# Altium project ASV4-1 Actuation Driver Board.PrjPcb (part 2 of 3)

## Sheet ISO_CAN.SchDoc
size C; SheetNumber: 6; SheetTotal: 6
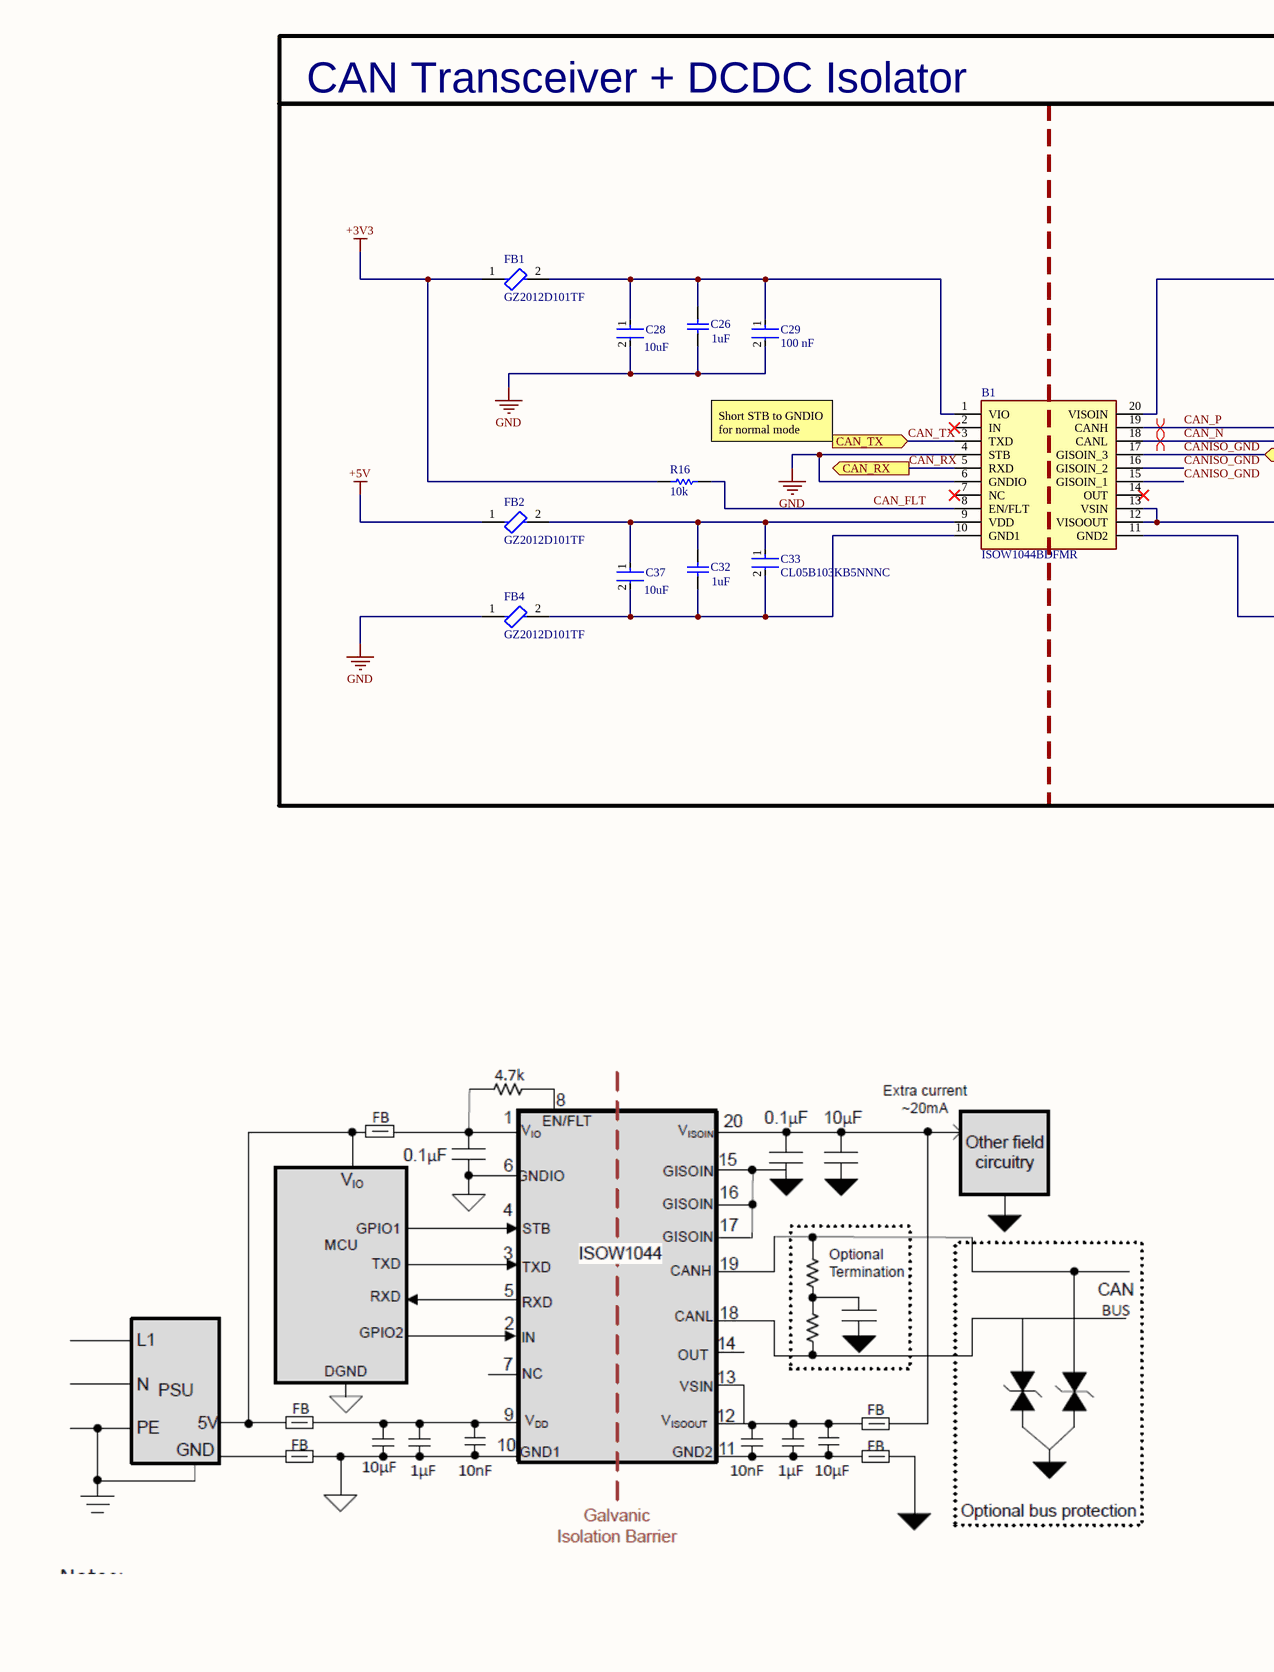
[diagram p4: ISO_CAN.SchDoc, top left]
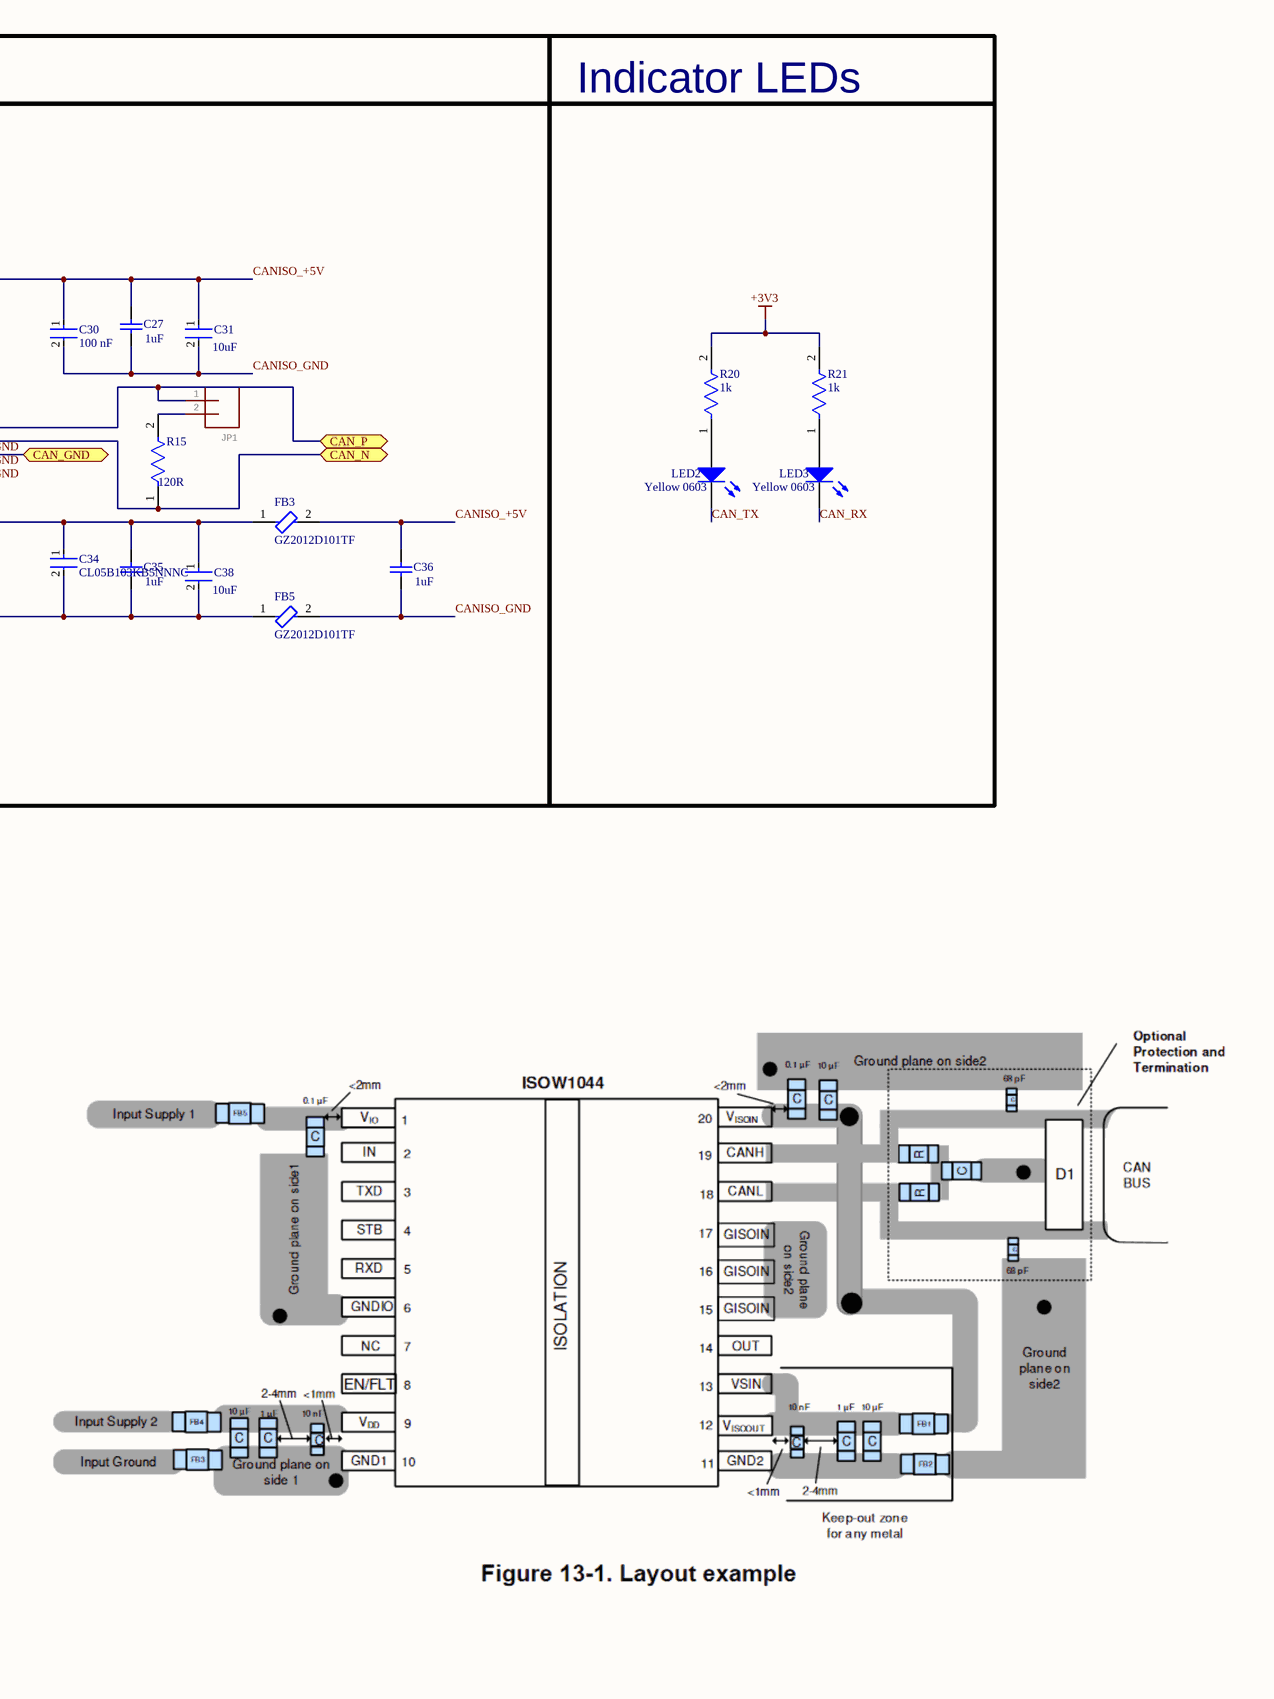
[diagram p5: ISO_CAN.SchDoc, top right]
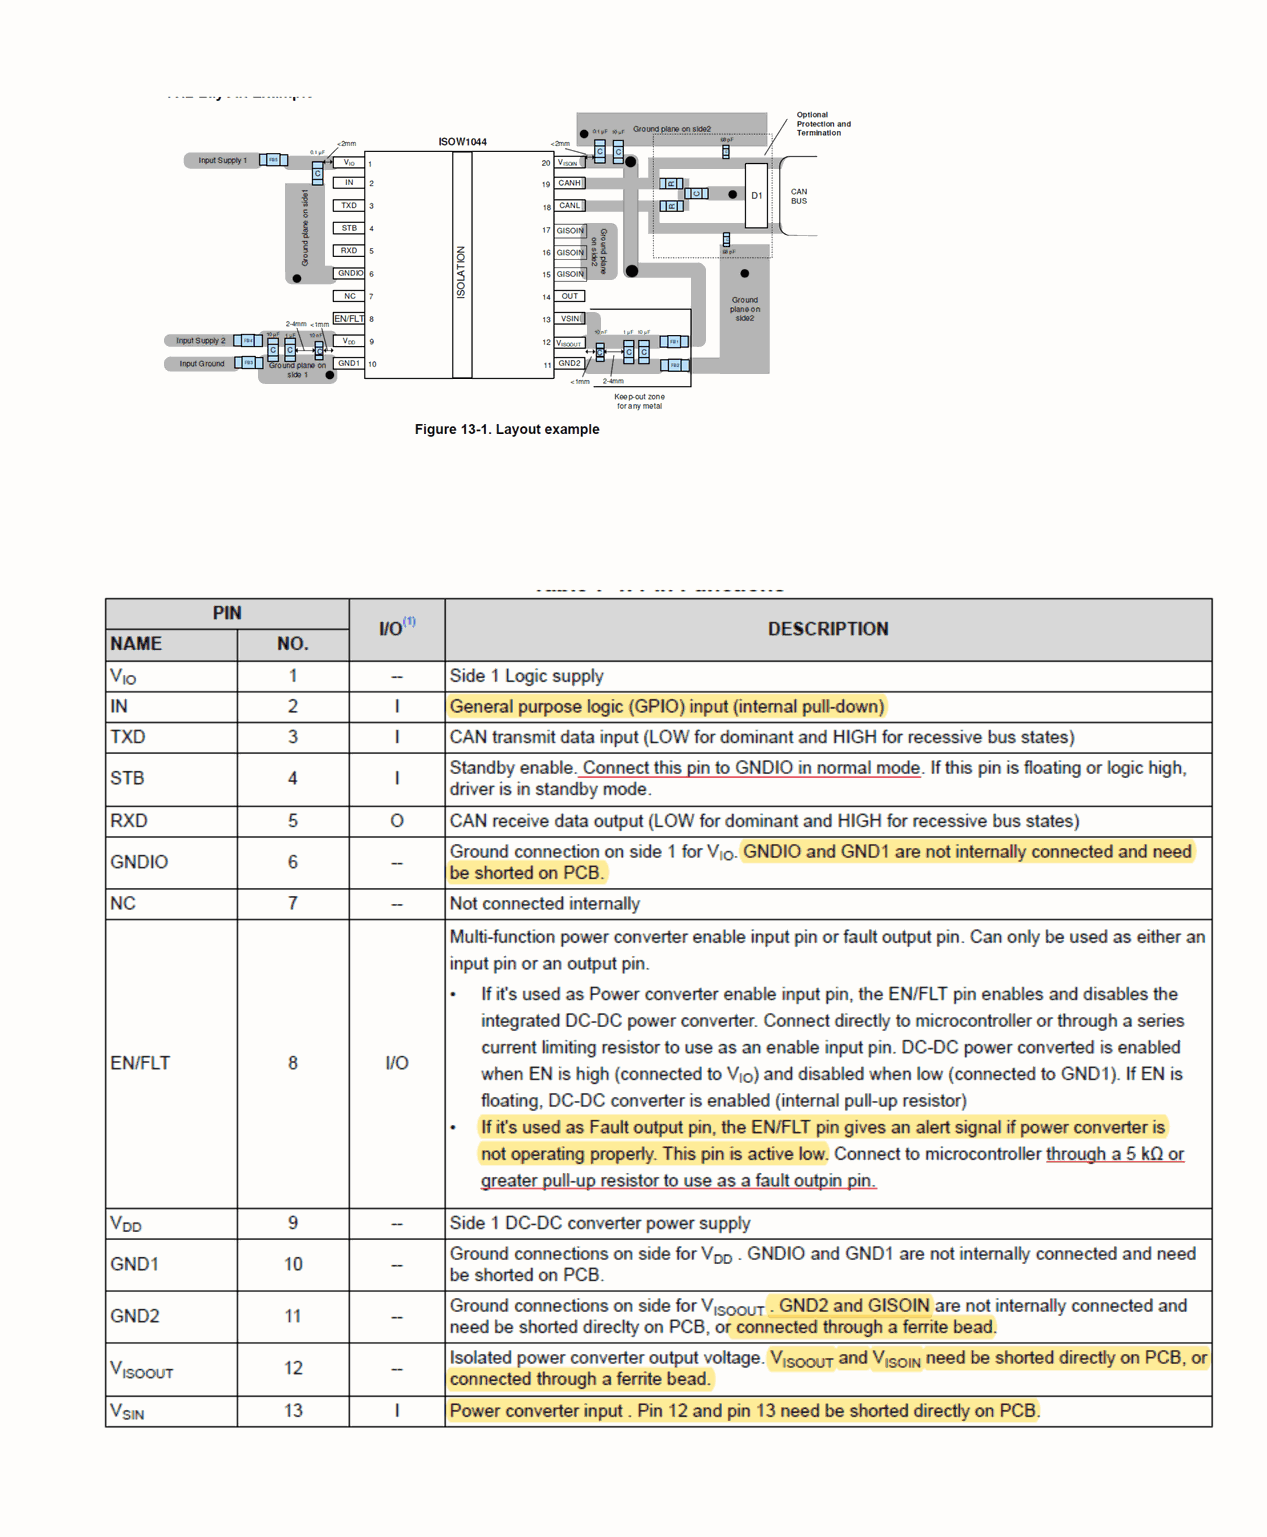
[diagram p6: ISO_CAN.SchDoc, bottom left]
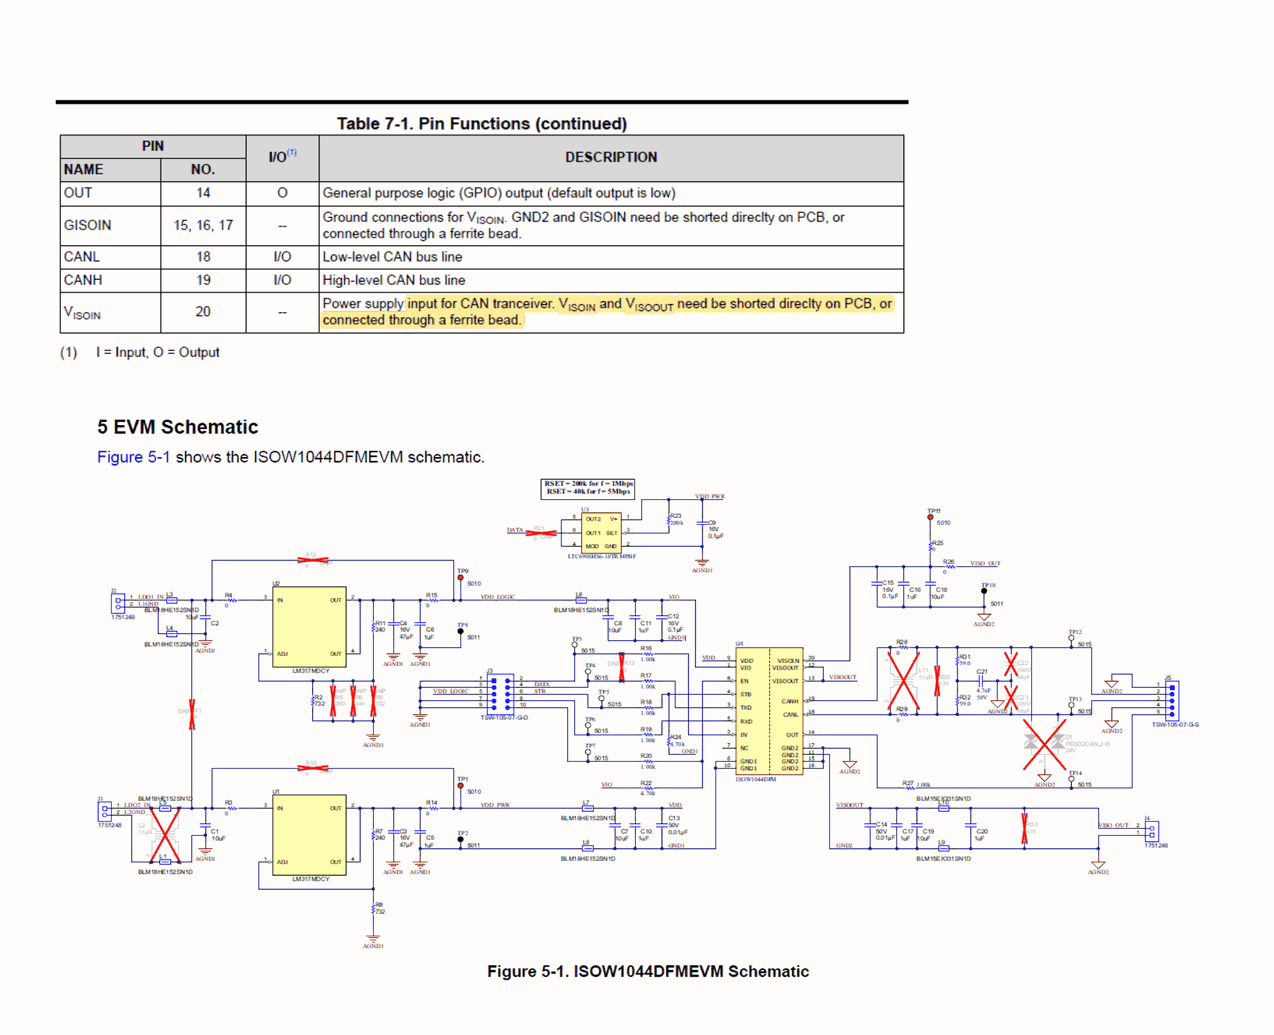
[diagram p7: ISO_CAN.SchDoc, bottom right]

### Parts
B1  ISOW1044BDFMR  [SOIC127P1030X355-20N]
C26  value 1uF  [CAPC1608X95N]  (hidden comment: 1uF 0603)
C27  value 1uF  [CAPC1608X95N]  (hidden comment: 1uF 0603)
C28  Capacitance: 10uF  [FP-GRM21B-0_2-e0_2_0_7-IPC_A]  (hidden comment: GRM21BR61H106KE43L)
C29  Capacitance: 100 nF  [FP-CC0603-DA-MFG]  (hidden comment: CC0603KRX7R9BB104)
C30  Capacitance: 100 nF  [FP-CC0603-DA-MFG]  (hidden comment: CC0603KRX7R9BB104)
C31  Capacitance: 10uF  [FP-GRM21B-0_2-e0_2_0_7-IPC_A]  (hidden comment: GRM21BR61H106KE43L)
C32  value 1uF  [CAPC1608X95N]  (hidden comment: 1uF 0603)
C33  CL05B103KB5NNNC  [FP-CL165-IPC_C]
C34  CL05B103KB5NNNC  [FP-CL165-IPC_C]
C35  value 1uF  [CAPC1608X95N]  (hidden comment: 1uF 0603)
C36  value 1uF  [CAPC1608X95N]  (hidden comment: 1uF 0603)
C37  Capacitance: 10uF  [FP-GRM21B-0_2-e0_2_0_7-IPC_A]  (hidden comment: GRM21BR61H106KE43L)
C38  Capacitance: 10uF  [FP-GRM21B-0_2-e0_2_0_7-IPC_A]  (hidden comment: GRM21BR61H106KE43L)
FB1  GZ2012D101TF  [FP-BLM21-0_2-t0_85-e0_5-IPC_A]
FB2  GZ2012D101TF  [FP-BLM21-0_2-t0_85-e0_5-IPC_A]
FB3  GZ2012D101TF  [FP-BLM21-0_2-t0_85-e0_5-IPC_A]
FB4  GZ2012D101TF  [FP-BLM21-0_2-t0_85-e0_5-IPC_A]
FB5  GZ2012D101TF  [FP-BLM21-0_2-t0_85-e0_5-IPC_A]
JP1  Multi connection point. Often used as Generic Header-pin footprint for 0.1 inch spaced/style header connections    On any of the 0.1 inch spaced packages, you can populate with these:  Break Away Headers - Straight (PRT-00116)   Break Away Male Headers - Right Angle (PRT-00553)   Female Headers (PRT-00115)   Break Away Headers - Machine Pin (PRT-00117)   Break Away Female Headers - Swiss Machine Pin (PRT-00743)        For SCREWTERMINALS and SPRING TERMINALS visit here:  Screw Terimnals on SparkFun.com (5mm/3.5mm/2.54mm spacing)       This device is also useful as a general connection point to wire up your design to another part of your project. Our various solder wires solder well into these plated through hole pads.  Hook-Up Wire - Assortment (Stranded, 22 AWG) (PRT-11375)   Hook-Up Wire - Assortment (Solid Core, 22 AWG) (PRT-11367)   View the entire wire category on our website here          Special notes: Molex polarized connector foot print use with: PRT-08233 with associated crimp pins and housings.  2.54_SCREWTERM for use with  PRT-10571.  3.5mm Screw Terminal footprints for  PRT-08084  5mm Screw Terminal footprints for use with PRT-08432  [1X02_LOCK]  (value not drawn)
LED2  Yellow 0603  [0603_A]
LED3  Yellow 0603  [0603_A]
R15  Resistance: 120R  [FP-CRCW0603-e3-MFG]  (hidden comment: 0603WAF1200T5E)
R16  Resistance: 10k  [RESC1609X50X30NL8T20]  (hidden comment: 0603WAF1002T5E)
R20  1k  [FP-RC0603-0_55-IPC_C]
R21  1k  [FP-RC0603-0_55-IPC_C]

### Blocks framed on the sheet
CAN Transceiver + DCDC Isolator: B1 C26-C38 FB1-FB5 JP1 R15 R16
Indicator LEDs: LED2 LED3 R20 R21

### Ports
CAN_GND (bidir, see Actuation[2A]), CAN_N (bidir, see Actuation[2A]), CAN_P (bidir, see Actuation[2A]), CAN_RX (out, see Actuation[2A]), CAN_TX (in, see Actuation[2A])

### Nets
+3V3: FB1.1 R16.1 R20.2 R21.2
+5V: FB2.1
GND: B1.4(STB) B1.6(GNDIO) C26.1 C28.2 C29.2 FB4.1
CAN_FLT: B1.8(EN/FLT) R16.2
CAN_N: B1.18(CANL) R15.1 ; port CAN_N
CAN_P: B1.19(CANH) JP1.1 ; port CAN_P
CAN_RX: B1.5(RXD) LED3.1(K) ; port CAN_RX  [project net CAN1_RX]
CAN_TX: B1.3(TXD) LED2.1(K) ; port CAN_TX  [project net CAN1_TX]
CANISO_+5V: B1.20(VISOIN) C27.2 C30.1 C31.1 C36.2 FB3.2
CANISO_GND: B1.15(GISOIN_1) B1.16(GISOIN_2) B1.17(GISOIN_3) C27.1 C30.2 C31.2 C36.1 FB5.2 ; port CAN_GND  [project net CAN_GND_ISO]
NetB1_1: B1.1(VIO) C26.2 C28.1 C29.1 FB1.2
NetB1_9: B1.9(VDD) C32.2 C33.1 C37.1 FB2.2
NetB1_10: B1.10(GND1) C32.1 C33.2 C37.2 FB4.2
NetB1_11: B1.11(GND2) C34.2 C35.1 C38.2 FB5.1
NetB1_12: B1.12(VISOOUT) B1.13(VSIN) C34.1 C35.2 C38.1 FB3.1
NetJP1_2: JP1.2 R15.2
NetLED2_2: LED2.2(A) R20.1
NetLED3_2: LED3.2(A) R21.1

Not connected (* = marked no-connect by the designer): B1 2(IN)* 7(NC)* 14(OUT)*

### Layout directives
differential pair: CAN_N, CAN_P

### Notes on the sheet
- Short STB to GNDIO for normal mode

### Library data of the parts
B1 = CMP-194-000000-2: Texas Instruments; Geometry.Height: 3.55mm; Mouser Price/Stock: https://www.mouser.co.uk/ProductDetail/Texas-Instruments/ISOW1044BDFMR?qs=Li%252BoUPsLEnsRP1xV2fQwnw%3D%3D; Source: ISOW1044BDFMR.SchLib; Manufacturer_Part_Number: ISOW1044BDFMR; Design Item ID: ISOW1044BDFMR; Manufacturer_Name: Texas Instruments; Datasheet Link: https://www.ti.com/lit/ds/symlink/isow1044.pdf?ts=1645295421849&ref_url=https%253A%252F%252Fwww.google.com%252F; Mouser Part Number: 595-ISOW1044BDFMR
C26 C27 C32 C35 C36 = CMP-00099-1: as C20 on sheet Power; Capacitor Type: Ceramic; Height: 0.9mm; Package Shape: Rectangular; JESD-609 Code: e3; Terminal Finish: Nickel; Length: 1.6mm; Package Style: SMTMeter; RoHS Compliant: Yes; Mounting Technology: Surface Mount; Case/Package: 0603; Rated DC Voltage (URdc): 50V; Pins: 2; Min Operating Temperature: -55°C; Max Operating Temperature: 85°C; Dielectric Material: Ceramic; Width: 0.8mm; Termination: Wraparound; Packaging: Tape and Reel; Tolerance (fill in as +-): 10%; Tolerance  (fill in as +-): 10%; Reach SVHC Compliant: Yes; Temperature Characteristics Code: X5R
C28 C31 C37 C38 = CMP-06035-004402-1: Chip Multilayer Ceramic Capacitors for General Purpose, 0805, 10uF, X5R, 15%, 10%, 50V; Voltage Rating (DC): 50V; Dielectric: X5R; Tolerance: 10%; Thickness: 1.25mm; Length: 2mm; Width: 1.25mm
C29 C30 = CMP-2100-03601-2: as C4 on sheet Actuation; Height: 0.9mm; Voltage: 50 V; ComponentLink2Description: Datasheet; Device Class L2: Capacitors; Temperature Range High: +125°C; Category: Cap; Footprint Url: http://www.yageo.com/exep/pages/download/literatures/UPY-C_GEN_24.pdf; ComponentLink2URL: http://www.yageo.com/documents/recent/UPY-GPHC_X7R_6.3V-to-50V_18.pdf; Package: CC0603-DA; Temperature: -55°C to +125°C; Voltage Rating: 50 V; Temperature Characteristic: X7R; Device Class L1: Passive Components; Temperature Range Low: -55°C; Manufacturer Part Number: CC0603KRX7R9BB104; RoHS: TRUE; Automotive: No; Device Class L3: Ceramic Capacitors; Octopart: https://octopart.com/cc0603krx7r9bb104-yageo-42244635; Mouser Description: Multilayer Ceramic Capacitor, CC Series, 0.1 - F, - 10%, X7R, 50 V, 0603 [1608 Metric]; Lead Free: Yes; Digikey Description: CAP CER 0.1UF 50V X7R 0603
C33 C34 = CMP-13271-000387-1: Cap Ceramic 10nF 50V X7R ±10% SMD 0402 +125°C Paper T/R; Depth: 0.5mm; Length: 1mm; Lead Free: Lead Free; Case Code (Metric): 1005; Width: 0.02inch; Min Operating Temperature: -55°C; Thickness: 0.022inch; Package Quantity: 1; Mount: Surface Mount; Height: 0.5mm; Voltage: 50V; Material: Ceramic; Tolerance: 10%; Case Code (Imperial): 0402; Radiation Hardening: No; Case/Package: 0402; Max Operating Temperature: 125°C; Voltage Rating (DC): 50V; Contact Plating: Tin; Packaging: Tape and Reel; Voltage Rating: 50V; Capacitance: 10nF; Dielectric: X7R
FB1-FB5 = CMP-0686-00716-3: ±25% 100Ω@100MHz 0805 Ferrite Beads ROHS; Number of Lines: 1; Test Frequency: 100MHz; Impedance: 100R; Width: 1.25mm; Number of Circuits: 1; Height: 0.85mm; Min Operating Temperature: -55°C; Termination: SMD/SMT; Core Material: Ferrite; Number of Pins: 2; Case/Package: 0805; Case Code (Imperial): 0805; Frequency: 100MHz; Depth: 1.25mm; Length: 2mm; Case Code (Metric): 2012
JP1 = CONN_02LOCK: GateName_1: J1; DeviceName: LOCK; SymbolName_1: CONN_02; LibraryName: SparkFun-Connectors; DeviceSetName: CONN_02; Package: 1X02_LOCK
LED2 LED3 = CMP-00009-2: Led, Yellow, 590 Nm, 2 V, 30 Ma, 120 Mcd Rohs Compliant: Yes; Manufacturer Part No.: 150060YS75000; Test Current: 20mA; Dominant Wavelength: 590nm; Forward Current: 30mA; Viewing Angle: 140°; Lens Style: Clear,Rectangular; Forward Voltage: 2V; Luminous Intensity: 120mcd; Package Quantity: 1; Width: 0.8mm; Reach SVHC Compliant: Unknown; RoHS Compliant: Yes; Packaging: Cut Tape; Case Code (Imperial): 0603; Color: Yellow; Max Operating Temperature: 85°C; Case Code (Metric): 1608; Wavelength: 590nm; Series: WL-SMCW; Min Operating Temperature: -40°C; Case/Package: 0603; Height: 0.7mm; Length: 1.6mm; Mounting Technology: Surface Mount
R15 = CMP-1666-00020-3: 100mW Thick Film Resistors 75V ±100ppm/℃ ±1% 120Ω 0603 Chip Resistor - Surface Mount ROHS; Temperature Coefficient: 100ppm/°C; RoHS Compliant: Yes; Lead Free: Lead Free; Termination: SMD/SMT; Radiation Hardening: No; Case Code (Imperial): 0603; Series: CRCW; Resistance Tolerance: 1%; Number of Terminations: 2; Tolerance: 1%; Max Operating Temperature: 155°C; Power Rating: 100mW; Contact Plating: Tin; Package Quantity: 10; Max Power Dissipation: 100mW; Case Code (Metric): 1608; Weight: 7.1E-05oz; Packaging: Tape and Reel; Working Voltage: 75V; Mount: Surface Mount; Military Standard: Not; Construction: Rectangular; Features: Automotive AEC-Q200; Depth: 0.85mm; Min Operating Temperature: -55°C; Case/Package: 0603; Height: 0.45mm; Voltage Rating (DC): 75V; Width: 0.033inch; Technology: THICK FILM; Length: 1.55mm; Voltage Rating: 75V; Resistor Type: Thick Film
R16 = CMP-1666-00005-4: as R18 on sheet Actuation; Max Operating Temperature: 155 degC; Voltage Rating: 75 V; PackageDescription: 2-Pin Surface Mount Device, Body 1.575 x 0.85 mm; ComponentLink1Description: Manufacturer URL; RoHSCompliant: true; PackageReference: 0603; REACH SVHC: Unknown; Length: 1.55 mm; Packaging: Tape and Reel; Min Operating Temperature: -55 degC; Mounting Technology: Surface Mount; ComponentLink2URL: https://datasheet.ciiva.com/11809/0900766b80d98afc-11809037.pdf; Height: 0.45 mm; ComponentLink2Description: Datasheet; Package Quantity: 5000; ComponentLink1URL: http://www.vishay.com/
R20 R21 = CMP-1659-00009-5: as R17 on sheet Actuation; Military Standard: Not; REACH SVHC: No SVHC; Size Code: 0603; Features: Moisture Resistant; Number of Terminations: 2; Technology: THICK FILM; Series: RC; Case Code (Metric): 1608; Resistance Tolerance: 1%; Resistor Type: Thick Film; Termination: SMD/SMT; Contact Plating: Tin; Radiation Hardening: No; Min Operating Temperature: -55°C; Max Operating Temperature: 155°C; Packaging: Tape and Reel; Max Power Dissipation: 100mW; RoHS Compliant: Yes; Height: 0.45mm; Lead Free: Lead Free; Case/Package: 0603; Length: 1.6mm; Tolerance: 1%; Case Code (Imperial): 0603; Construction: Rectangular; Depth: 0.8mm

## Sheet STM32F407VET6.SchDoc
size A3; SheetNumber: 2; SheetTotal: 6
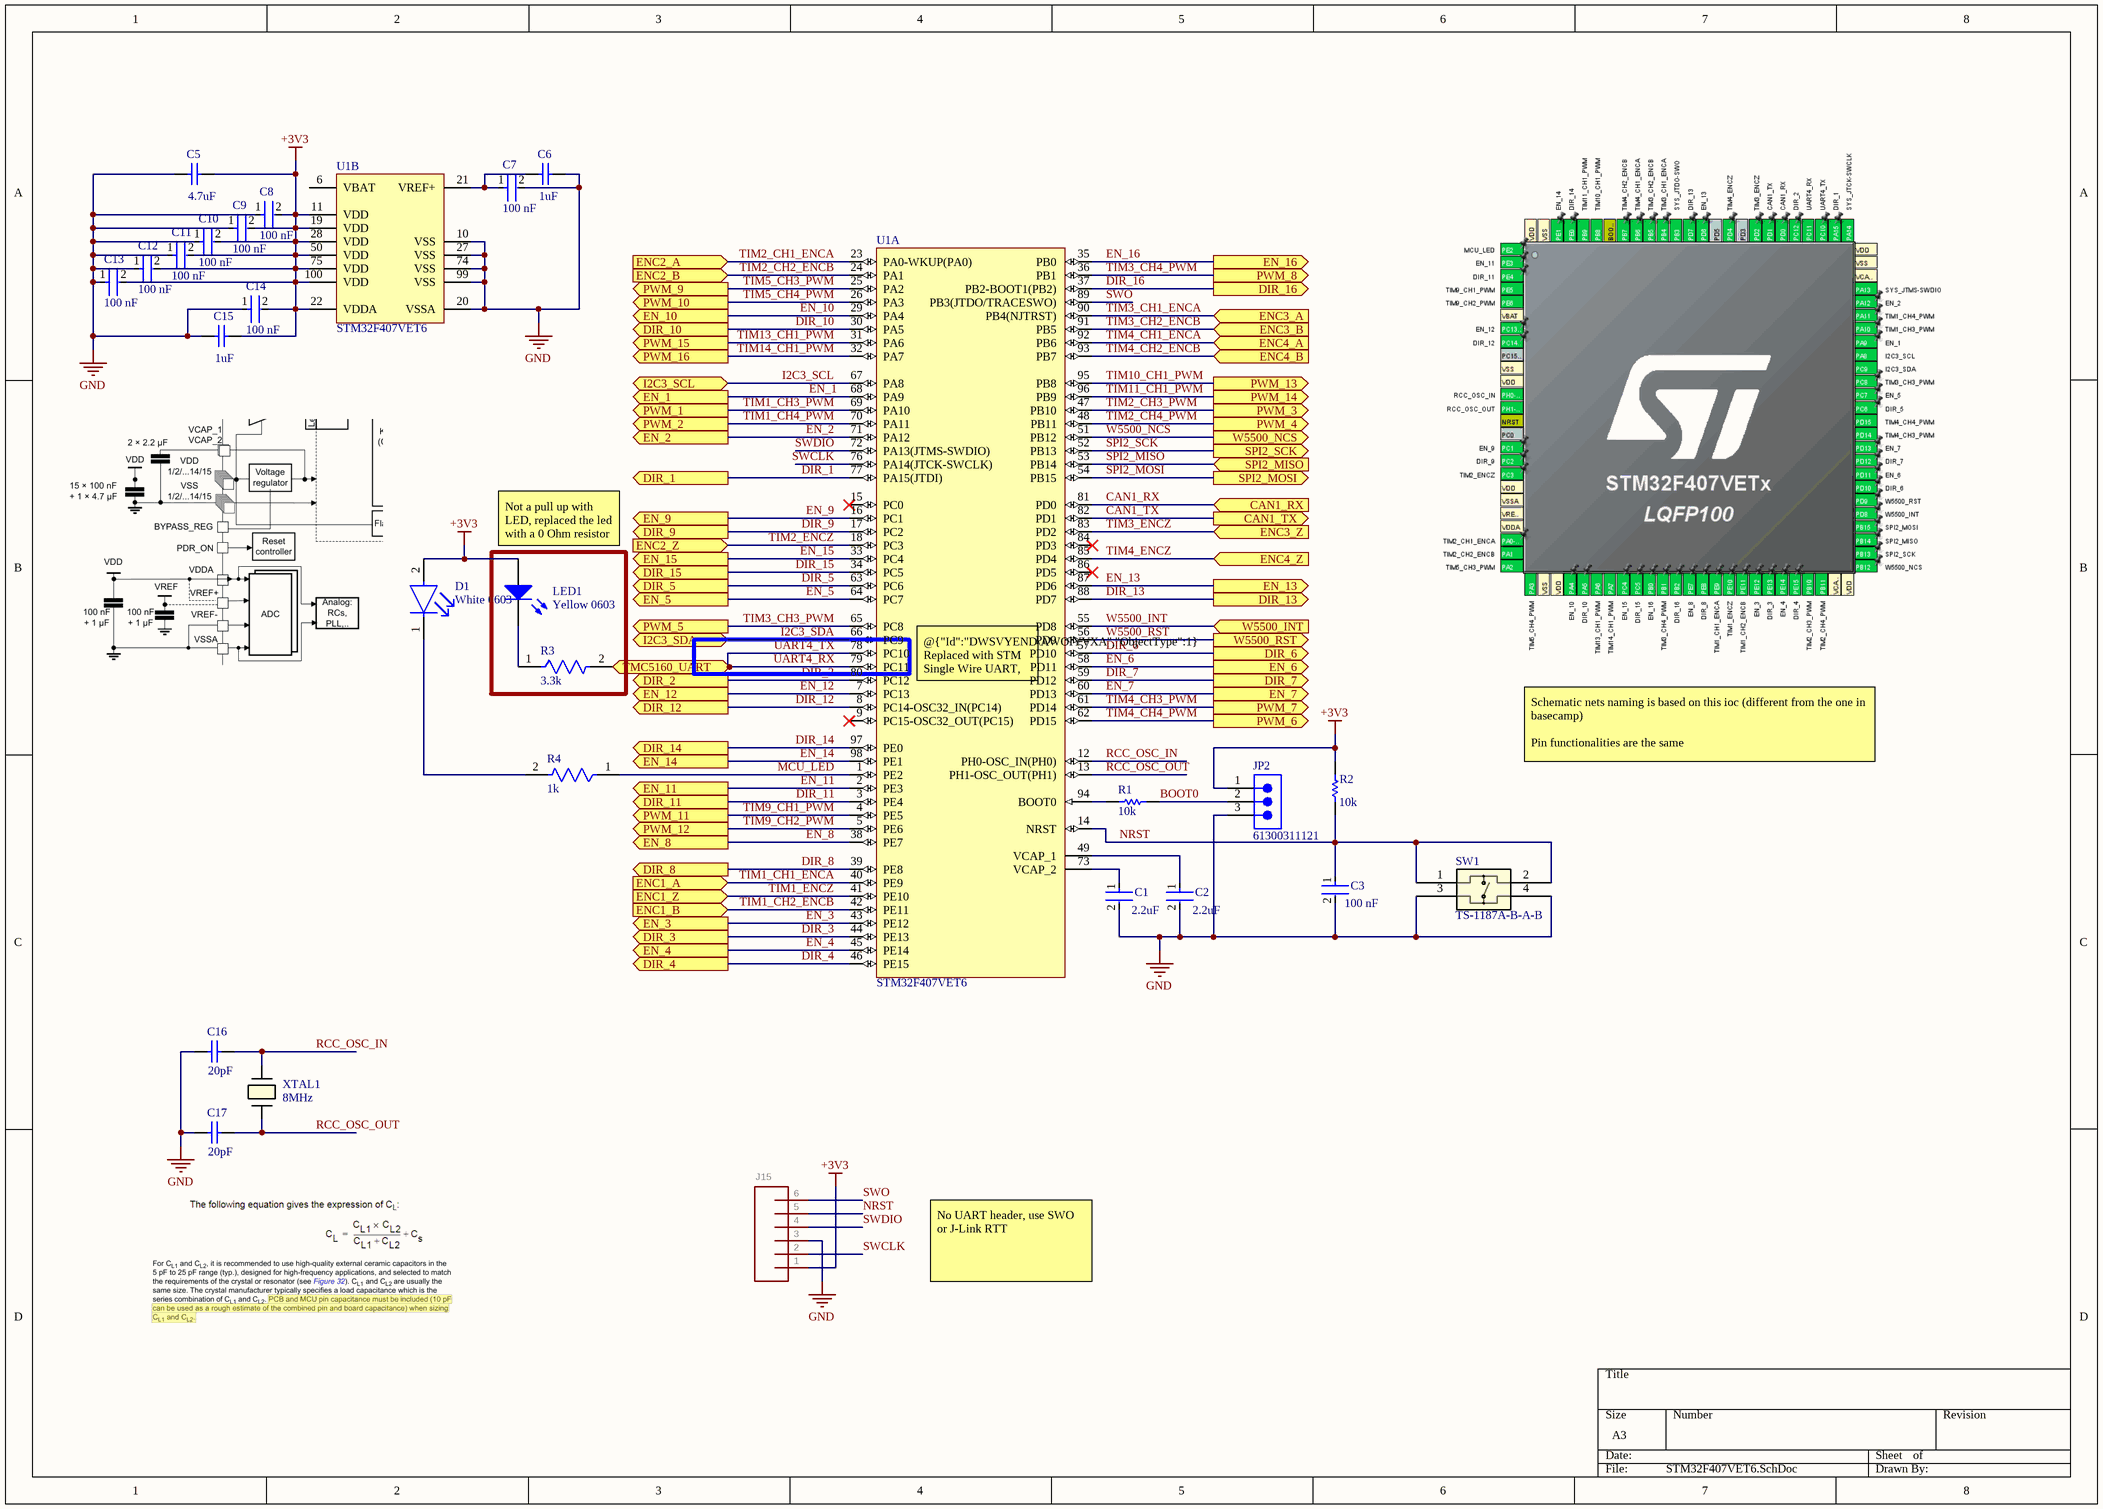
[diagram p8: STM32F407VET6.SchDoc]

### Parts
C1  Capacitance: 2.2uF  [FP-CL10-IPC_A]  (hidden comment: CL10A225KO8NNNC)
C2  Capacitance: 2.2uF  [FP-CL10-IPC_A]  (hidden comment: CL10A225KO8NNNC)
C3  Capacitance: 100 nF  [FP-CC0603-DA-MFG]  (hidden comment: CC0603KRX7R9BB104)
C5  value 4.7uF  [CAPC1608X95N]  (hidden comment: 4.7uF 0603)
C6  value 1uF  [CAPC1608X95N]  (hidden comment: 1uF 0603)
C7  Capacitance: 100 nF  [FP-CC0603-DA-MFG]  (hidden comment: CC0603KRX7R9BB104)
C8  Capacitance: 100 nF  [FP-CC0603-DA-MFG]  (hidden comment: CC0603KRX7R9BB104)
C9  Capacitance: 100 nF  [FP-CC0603-DA-MFG]  (hidden comment: CC0603KRX7R9BB104)
C10  Capacitance: 100 nF  [FP-CC0603-DA-MFG]  (hidden comment: CC0603KRX7R9BB104)
C11  Capacitance: 100 nF  [FP-CC0603-DA-MFG]  (hidden comment: CC0603KRX7R9BB104)
C12  Capacitance: 100 nF  [FP-CC0603-DA-MFG]  (hidden comment: CC0603KRX7R9BB104)
C13  Capacitance: 100 nF  [FP-CC0603-DA-MFG]  (hidden comment: CC0603KRX7R9BB104)
C14  Capacitance: 100 nF  [FP-CC0603-DA-MFG]  (hidden comment: CC0603KRX7R9BB104)
C15  value 1uF  [CAPC1608X95N]  (hidden comment: 1uF 0603)
C16  Capacitance: 20pF  [CAPC1608X90X30LL10T20]  (hidden comment: CL10C200JB8NNNC)
C17  Capacitance: 20pF  [CAPC1608X90X30LL10T20]  (hidden comment: CL10C200JB8NNNC)
D1  White 0603  [FP-150060BS75000-MFG]
J15  Multi connection point. Often used as Generic Header-pin footprint for 0.1 inch spaced/style header connections    On any of the 0.1 inch spaced packages, you can populate with these:  Break Away Headers - Straight (PRT-00116)   Break Away Male Headers - Right Angle (PRT-00553)   Female Headers (PRT-00115)   Break Away Headers - Machine Pin (PRT-00117)   Break Away Female Headers - Swiss Machine Pin (PRT-00743)   Arduino Stackable Header - 6 Pin (PRT-09280)   Screw Terminals 2.54mm Pitch (6-Pin) (PRT-16499)        For SCREWTERMINALS and SPRING TERMINALS visit here:  Screw Terimnals on SparkFun.com (5mm/3.5mm/2.54mm spacing)       This device is also useful as a general connection point to wire up your design to another part of your project. Our various solder wires solder well into these plated through hole pads.  Hook-Up Wire - Assortment (Stranded, 22 AWG) (PRT-11375)   Hook-Up Wire - Assortment (Solid Core, 22 AWG) (PRT-11367)   View the entire wire category on our website here  [1X06_LOCK]  (value not drawn)
JP2  61300311121  [1x03_Locking]
LED1  Yellow 0603  [0603_A]
R1  Resistance: 10k  [RESC1609X50X30NL8T20]  (hidden comment: 0603WAF1002T5E)
R2  Resistance: 10k  [RESC1609X50X30NL8T20]  (hidden comment: 0603WAF1002T5E)
R3  3.3k  [FP-AC0603-IPC_C]
R4  1k  [FP-RC0603-0_55-IPC_C]
SW1  TS-1187A-B-A-B  [TS-1187A-B-A-B_XKB]
U1  STM32F407VET6  [STM-LQFP100_M]  (parts A,B of 2)
XTAL1  8MHz  [XTAL_MSB2GI_YXC]

### Ports
CAN1_RX (in, see Actuation[4A]), CAN1_TX (out, see Actuation[4A]), DIR_1 (out, see Actuation[5A]), DIR_2 (out, see Actuation[5A]), DIR_3 (out, see Actuation[5A]), DIR_4 (out, see Actuation[5A]), DIR_5 (out, see Actuation[5A]), DIR_6 (out, see Actuation[5A]), DIR_7 (out, see Actuation[5A]), DIR_8 (out, see Actuation[5B]), DIR_9 (out, see Actuation[5B]), DIR_10 (out, see Actuation[5B]), DIR_11 (out, see Actuation[5B]), DIR_12 (out, see Actuation[5B]), DIR_13 (out, see Actuation[5B]), DIR_14 (out, see Actuation[5B]), DIR_15 (out, see Actuation[5B]), DIR_16 (out, see Actuation[5B]), EN_1 (out, see Actuation[5A]), EN_2 (out, see Actuation[5A]), EN_3 (out, see Actuation[5A]), EN_4 (out, see Actuation[5A]), EN_5 (out, see Actuation[5A]), EN_6 (out, see Actuation[5A]), EN_7 (out, see Actuation[5A]), EN_8 (out, see Actuation[5B]), EN_9 (out, see Actuation[5B]), EN_10 (out, see Actuation[5B]), EN_11 (out, see Actuation[5B]), EN_12 (out, see Actuation[5B]), EN_13 (out, see Actuation[5B]), EN_14 (out, see Actuation[5B]), EN_15 (out, see Actuation[5B]), EN_16 (out, see Actuation[5B]), ENC1_A (in, see Actuation[4B]), ENC1_B (in, see Actuation[4B]), ENC1_Z (in, see Actuation[4B]), ENC2_A (in, see Actuation[4B]), ENC2_B (in, see Actuation[4B]), ENC2_Z (in, see Actuation[4B]), ENC3_A (in, see Actuation[4B]), ENC3_B (in, see Actuation[4B]), ENC3_Z (in, see Actuation[4B]), ENC4_A (in, see Actuation[4B]), ENC4_B (in, see Actuation[4B]), ENC4_Z (in, see Actuation[4B]), I2C3_SCL (bidir, see Actuation[5B]), I2C3_SDA (bidir, see Actuation[5B]), PWM_1 (out, see Actuation[5A]), PWM_2 (out, see Actuation[5A]), PWM_3 (out, see Actuation[5A]), PWM_4 (out, see Actuation[5A]), PWM_5 (out, see Actuation[5A]), PWM_6 (out, see Actuation[5A]), PWM_7 (out, see Actuation[5A]), PWM_8 (out, see Actuation[5B]), PWM_9 (out, see Actuation[5B]), PWM_10 (out, see Actuation[5B]), PWM_11 (out, see Actuation[5B]), PWM_12 (out, see Actuation[5B]), PWM_13 (out, see Actuation[5B]), PWM_14 (out, see Actuation[5B]), PWM_15 (out, see Actuation[5B]), PWM_16 (out, see Actuation[5B]), SPI2_MISO (in, see Actuation[4A]), SPI2_MOSI (out, see Actuation[4A]), SPI2_SCK (out, see Actuation[4A]), TMC5160_UART (bidir, see Actuation[4B]), W5500_INT (in, see Actuation[4A]), W5500_NCS (out, see Actuation[4A]), W5500_RST (out, see Actuation[4A])

### Nets
+3V3: C5.2 C8.2 C9.2 C10.2 C11.2 C12.2 C13.2 C14.2 C15.2 D1.2(A) J15.1 JP2.1 LED1.2(A) R2.1 U1.11(VDD) U1.19(VDD) U1.22(VDDA) U1.28(VDD) U1.50(VDD) U1.75(VDD) U1.100(VDD)
GND: C1.2 C2.2 C3.2 C5.1 C6.2 C7.2 C8.1 C9.1 C10.1 C11.1 C12.1 C13.1 C14.1 C15.1 C16.1 C17.1 J15.3 JP2.3 SW1.3 SW1.4 U1.10(VSS) U1.20(VSSA) U1.27(VSS) U1.74(VSS) U1.99(VSS)
BOOT0: JP2.2 R1.2
CAN1_RX: U1.81(PD0) ; port CAN1_RX
CAN1_TX: U1.82(PD1) ; port CAN1_TX
DIR_1: U1.77(PA15(JTDI)) ; port DIR_1
DIR_2: U1.80(PC12) ; port DIR_2
DIR_3: U1.44(PE13) ; port DIR_3
DIR_4: U1.46(PE15) ; port DIR_4
DIR_5: U1.63(PC6) ; port DIR_5
DIR_6: U1.57(PD10) ; port DIR_6
DIR_7: U1.59(PD12) ; port DIR_7
DIR_8: U1.39(PE8) ; port DIR_8
DIR_9: U1.17(PC2) ; port DIR_9
DIR_10: U1.30(PA5) ; port DIR_10
DIR_11: U1.3(PE4) ; port DIR_11
DIR_12: U1.8(PC14-OSC32_IN(PC14)) ; port DIR_12
DIR_13: U1.88(PD7) ; port DIR_13
DIR_14: U1.97(PE0) ; port DIR_14
DIR_15: U1.34(PC5) ; port DIR_15
DIR_16: U1.37(PB2-BOOT1(PB2)) ; port DIR_16
EN_1: U1.68(PA9) ; port EN_1
EN_2: U1.71(PA12) ; port EN_2
EN_3: U1.43(PE12) ; port EN_3
EN_4: U1.45(PE14) ; port EN_4
EN_5: U1.64(PC7) ; port EN_5
EN_6: U1.58(PD11) ; port EN_6
EN_7: U1.60(PD13) ; port EN_7
EN_8: U1.38(PE7) ; port EN_8
EN_9: U1.16(PC1) ; port EN_9
EN_10: U1.29(PA4) ; port EN_10
EN_11: U1.2(PE3) ; port EN_11
EN_12: U1.7(PC13) ; port EN_12
EN_13: U1.87(PD6) ; port EN_13
EN_14: U1.98(PE1) ; port EN_14
EN_15: U1.33(PC4) ; port EN_15
EN_16: U1.35(PB0) ; port EN_16  [project net BUZZER]
I2C3_SCL: U1.67(PA8) ; port I2C3_SCL
I2C3_SDA: U1.66(PC9) ; port I2C3_SDA
MCU_LED: R4.1 U1.1(PE2)
NRST: C3.1 J15.5 R2.2 SW1.1 SW1.2 U1.14(NRST)
RCC_OSC_IN: C16.2 U1.12(PH0-OSC_IN(PH0)) XTAL1.2
RCC_OSC_OUT: C17.2 U1.13(PH1-OSC_OUT(PH1)) XTAL1.1
SPI2_MISO: U1.53(PB14) ; port SPI2_MISO
SPI2_MOSI: U1.54(PB15) ; port SPI2_MOSI
SPI2_SCK: U1.52(PB13) ; port SPI2_SCK
SWCLK: J15.2 U1.76(PA14(JTCK-SWCLK))
SWDIO: J15.4 U1.72(PA13(JTMS-SWDIO))
SWO: J15.6 U1.89(PB3(JTDO/TRACESWO))
TIM1_CH1_ENCA: U1.40(PE9) ; port ENC1_A  [project net ENC1_A]
TIM1_CH2_ENCB: U1.42(PE11) ; port ENC1_B  [project net ENC1_B]
TIM1_CH3_PWM: U1.69(PA10) ; port PWM_1  [project net PWM_1]
TIM1_CH4_PWM: U1.70(PA11) ; port PWM_2  [project net PWM_2]
TIM1_ENCZ: U1.41(PE10) ; port ENC1_Z  [project net ENC1_Z]
TIM2_CH1_ENCA: U1.23(PA0-WKUP(PA0)) ; port ENC2_A  [project net ENC2_A]
TIM2_CH2_ENCB: U1.24(PA1) ; port ENC2_B  [project net ENC2_B]
TIM2_CH3_PWM: U1.47(PB10) ; port PWM_3  [project net PWM_3]
TIM2_CH4_PWM: U1.48(PB11) ; port PWM_4  [project net PWM_4]
TIM2_ENCZ: U1.18(PC3) ; port ENC2_Z  [project net ENC2_Z]
TIM3_CH1_ENCA: U1.90(PB4(NJTRST)) ; port ENC3_A  [project net ENC3_A]
TIM3_CH2_ENCB: U1.91(PB5) ; port ENC3_B  [project net ENC3_B]
TIM3_CH3_PWM: U1.65(PC8) ; port PWM_5  [project net PWM_5]
TIM3_CH4_PWM: U1.36(PB1) ; port PWM_8  [project net PWM_8]
TIM3_ENCZ: U1.83(PD2) ; port ENC3_Z  [project net ENC3_Z]
TIM4_CH1_ENCA: U1.92(PB6) ; port ENC4_A  [project net ENC4_A]
TIM4_CH2_ENCB: U1.93(PB7) ; port ENC4_B  [project net ENC4_B]
TIM4_CH3_PWM: U1.61(PD14) ; port PWM_7  [project net PWM_7]
TIM4_CH4_PWM: U1.62(PD15) ; port PWM_6  [project net PWM_6]
TIM4_ENCZ: U1.85(PD4) ; port ENC4_Z  [project net ENC4_Z]
TIM5_CH3_PWM: U1.25(PA2) ; port PWM_9  [project net PWM_9]
TIM5_CH4_PWM: U1.26(PA3) ; port PWM_10  [project net PWM_10]
TIM9_CH1_PWM: U1.4(PE5) ; port PWM_11  [project net PWM_11]
TIM9_CH2_PWM: U1.5(PE6) ; port PWM_12  [project net PWM_12]
TIM10_CH1_PWM: U1.95(PB8) ; port PWM_13  [project net PWM_13]
TIM11_CH1_PWM: U1.96(PB9) ; port PWM_14  [project net PWM_14]
TIM13_CH1_PWM: U1.31(PA6) ; port PWM_15  [project net PWM_15]
TIM14_CH1_PWM: U1.32(PA7) ; port PWM_16  [project net PWM_16]
UART4_RX: R3.2 U1.78(PC10) U1.79(PC11) ; port TMC5160_UART  [also labelled UART4_TX]  [project net TMC5160_UART]
W5500_INT: U1.55(PD8) ; port W5500_INT
W5500_NCS: U1.51(PB12) ; port W5500_NCS
W5500_RST: U1.56(PD9) ; port W5500_RST
NetC1_1: C1.1 U1.73(VCAP_2)
NetC2_1: C2.1 U1.49(VCAP_1)
NetC6_1: C6.1 C7.1 U1.21(VREF+)
NetD1_1: D1.1(C) R4.2
NetLED1_1: LED1.1(K) R3.1
NetR1_1: R1.1 U1.94(BOOT0)

Not connected (* = marked no-connect by the designer): U1 6(VBAT) 9(PC15-OSC32_OUT(PC15))* 15(PC0)* 84(PD3)* 86(PD5)*

### Notes on the sheet
- (near LED1) Not a pull up with LED, replaced the led with a 0 Ohm resistor
- (near U1) @{"Id":"DWSVYEND\AWOIYVXA","ObjectType":1}  Replaced with STM Single Wire UART, instead of using shorted TX/RX pins
- Schematic nets naming is based on this ioc (different from the one in basecamp)
  Pin functionalities are the same
- No UART header, use SWO or J-Link RTT

### Library data of the parts
C1 C2 = CMP-13271-000835-1: Cap Ceramic 2.2uF 16V X5R ±10% Pad SMD 0603 +85°C T/R; Case Code (Metric): 1608; Height: 0.8mm; Case/Package: 0603; Depth: 0.8mm; Voltage Rating: 16V; Case Code (Imperial): 0603; Length: 1.6mm; Packaging: Tape and Reel; Material: Ceramic; Lead Free: Lead Free; Max Operating Temperature: 85°C; Contact Plating: Tin; Thickness: 0.035inch; Radiation Hardening: No; Tolerance: 10%; Min Operating Temperature: -55°C; Voltage: 16V; Dielectric: X5R; Mount: Surface Mount; Package Quantity: 4000; Width: 0.031inch; Voltage Rating (DC): 16V
C3 C7-C14 = CMP-2100-03601-2: CAP CER 0.1UF 50V X7R 0603; Manufacturer: YAGEO; Material: Ceramic; Temperature Coefficient: 15%; Tolerance: 0.1; Value: 100 nF; Height: 0.9mm; Voltage: 50 V; ComponentLink2Description: Datasheet; Device Class L2: Capacitors; Temperature Range High: +125°C; Category: Cap; Footprint Url: http://www.yageo.com/exep/pages/download/literatures/UPY-C_GEN_24.pdf; ComponentLink2URL: http://www.yageo.com/documents/recent/UPY-GPHC_X7R_6.3V-to-50V_18.pdf; Package: CC0603-DA; Temperature: -55°C to +125°C; Voltage Rating: 50 V; Temperature Characteristic: X7R; Device Class L1: Passive Components; Temperature Range Low: -55°C; Manufacturer Part Number: CC0603KRX7R9BB104; RoHS: TRUE; Automotive: No; Device Class L3: Ceramic Capacitors; Octopart: https://octopart.com/cc0603krx7r9bb104-yageo-42244635; Mouser Description: Multilayer Ceramic Capacitor, CC Series, 0.1 - F, - 10%, X7R, 50 V, 0603 [1608 Metric]; Lead Free: Yes; Digikey Description: CAP CER 0.1UF 50V X7R 0603
C5 = CMP-123-000014-1: 16V 4.7uF X5R ±10% 0603 Multilayer Ceramic Capacitors MLCC - SMD/SMT ROHS; Dielectric: X7R; Series: WCAP-CSGP; Length: 1.6mm; Mounting Technology: Surface Mount; Case Code (Metric): 1608; Case/Package: 0603; Max Operating Temperature: 85°C; Voltage Rating (DC): 16V; RoHS Compliant: Yes; Case Code (Imperial): 0603; Width: 0.8mm; Voltage Rating: 16V; Reach SVHC Compliant: Yes; Tolerance: 10%; Packaging: Tape and Reel; Min Operating Temperature: -55°C; Thickness: 0.057inch
C6 C15 = CMP-00099-1: 1uF 0603, Ceramic Capacitor, Multilayer, Ceramic, 50V, 10% +Tol, 10% -Tol, X5R, 15% TC, 1uF, Surface Mount, 0603; Multilayer: Yes; Capacitor Type: Ceramic; Height: 0.9mm; Package Shape: Rectangular; JESD-609 Code: e3; Terminal Finish: Nickel; Length: 1.6mm; Package Style: SMTMeter; RoHS Compliant: Yes; Mounting Technology: Surface Mount; Case/Package: 0603; Rated DC Voltage (URdc): 50V; Pins: 2; Min Operating Temperature: -55°C; Max Operating Temperature: 85°C; Dielectric Material: Ceramic; Width: 0.8mm; Termination: Wraparound; Packaging: Tape and Reel; Tolerance (fill in as +-): 10%; Tolerance  (fill in as +-): 10%; Reach SVHC Compliant: Yes; Temperature Characteristics Code: X5R
C16 C17 = CMP-2000-06100-1: Chip Capacitor, 20 pF, +/- 5%, 50 V, -55 to 85 degC, 0603 (1608 Metric), RoHS, Tape and Reel; Manufacturer: Samsung Electro-Mechanics; Dielectric: C0G; Rated Voltage: 50V; Tolerance (%): ±5%; Case Size/Dimension: 0603; Datasheet Version: 06/2016; Manufacturer URL: http://www.samsungsem.com/global/index.jsp; Datasheet URL: http://www.samsungsem.com/kr/support/product-search/mlcc/__icsFiles/afieldfile/2016/08/18/S_CL10C200JB8NNNC.pdf; Mounting Technology: SurfaceMount; Package Description: 2-Pin Surface Mount Device, Body 1.60 x 0.80 mm; Package Reference: 0603
D1 = CMP-00012-1: White 0603 Light Emitting Diodes (LED) ROHS; Manufacturer Part No.: KT-0603W; Test Current: 20mA; Lens Color: Colorless; Forward Voltage: 3.2V; Lens Style: Clear,Flat,Rectangular; Dominant Wavelength: 470nm; Viewing Angle: 140°; Lens Transparency: Clear; Color: White; Packaging: Cut Tape; Reach SVHC Compliant: Unknown; Width: 0.8mm; Case Code (Imperial): 0603; Case Code (Metric): 1608; Package Quantity: 1; RoHS Compliant: Yes; Min Operating Temperature: -40°C; Mounting Technology: Surface Mount; Case/Package: 0603; Length: 1.6mm; Height: 0.8mm; Max Operating Temperature: 85°C
J15 = CONN_06LOCK: GateName_1: J1; DeviceName: LOCK; SymbolName_1: CONN_06; LibraryName: SparkFun-Connectors; DeviceSetName: CONN_06; Package: 1X06_LOCK
JP2 = CMP-141-000015-2: Board Connector, 3 Contact(s), 1 Row(s), Male, Straight, 0.1 inch Pitch, Solder Terminal, Locking, Black Insulator, Plug; Number of Contacts: 3
LED1 = CMP-00009-2: Led, Yellow, 590 Nm, 2 V, 30 Ma, 120 Mcd Rohs Compliant: Yes; Manufacturer Part No.: 150060YS75000; Test Current: 20mA; Dominant Wavelength: 590nm; Forward Current: 30mA; Viewing Angle: 140°; Lens Style: Clear,Rectangular; Forward Voltage: 2V; Luminous Intensity: 120mcd; Package Quantity: 1; Width: 0.8mm; Reach SVHC Compliant: Unknown; RoHS Compliant: Yes; Packaging: Cut Tape; Case Code (Imperial): 0603; Color: Yellow; Max Operating Temperature: 85°C; Case Code (Metric): 1608; Wavelength: 590nm; Series: WL-SMCW; Min Operating Temperature: -40°C; Case/Package: 0603; Height: 0.7mm; Length: 1.6mm; Mounting Technology: Surface Mount
R1 R2 = CMP-1666-00005-4: 100mW Thick Film Resistors 75V ±100ppm/℃ ±1% 10kΩ 0603 Chip Resistor - Surface Mount ROHS; Max Operating Temperature: 155 degC; Voltage Rating: 75 V; PackageDescription: 2-Pin Surface Mount Device, Body 1.575 x 0.85 mm; ComponentLink1Description: Manufacturer URL; RoHSCompliant: true; PackageReference: 0603; REACH SVHC: Unknown; Length: 1.55 mm; Packaging: Tape and Reel; Min Operating Temperature: -55 degC; Mounting Technology: Surface Mount; ComponentLink2URL: https://datasheet.ciiva.com/11809/0900766b80d98afc-11809037.pdf; Height: 0.45 mm; ComponentLink2Description: Datasheet; Package Quantity: 5000; ComponentLink1URL: http://www.vishay.com/
R3 = CMP-03412-024727-2: RES 3.3KΩ 1.00% 0.1W 0603; Temperature Coefficient: 100ppm/°C; Resistance: 3.3kR; Voltage Rating: 50V; Power Rating: 100mW; Tolerance: 1%; Resistor Type: Thick Film; Length: 1.6mm; Packaging: Tape and Reel; Case Code (Metric): 1608; Series: AC; Min Operating Temperature: -55°C; Case/Package: 0603; Depth: 0.8mm; Features: Moisture Resistant; Width: 0.8mm; Ratings: AEC-Q200; Case Code (Imperial): 0603; Size Code: 0603; RoHS Compliant: Yes; Military Standard: Not; Termination: SMD/SMT; Height: 0.45mm; Max Operating Temperature: 155°C; Max Power Dissipation: 100mW; Number of Terminations: 2; Lead Free: Lead Free; Construction: Rectangular
R4 = CMP-1659-00009-5: RC0603FR-071KL. RES 1K OHM 1% 1/10W 0603; Resistance: 1kR; Voltage Rating: 50V; Power Rating: 100mW; Temperature Coefficient: 100ppm/°C; Military Standard: Not; REACH SVHC: No SVHC; Size Code: 0603; Features: Moisture Resistant; Number of Terminations: 2; Technology: THICK FILM; Series: RC; Case Code (Metric): 1608; Resistance Tolerance: 1%; Resistor Type: Thick Film; Termination: SMD/SMT; Contact Plating: Tin; Radiation Hardening: No; Min Operating Temperature: -55°C; Max Operating Temperature: 155°C; Packaging: Tape and Reel; Max Power Dissipation: 100mW; RoHS Compliant: Yes; Height: 0.45mm; Lead Free: Lead Free; Case/Package: 0603; Length: 1.6mm; Tolerance: 1%; Case Code (Imperial): 0603; Construction: Rectangular; Depth: 0.8mm
SW1 = CMP-209-000001-3: No Without 50mA 5.1mm 100,000 Times 160gf 12V 5.1mm 1.5mm Round Button Brick nogging SPST SMD Tactile Switches ROHS; Mfr_Name: XKB Connectivity; Manufacturer_Name: XKB Connection; Design Item ID: TS-1187A-B-A-B; RefDes: RefDes; Type: Type; Source: TS-1187A-B-A-B.SchLib; JLCPCB Part #: C318884; Manufacturer_Part_Number: TS-1187A-B-A-B
U1 = CMP-0243-00016-3: ARM Cortex-M4 32-bit MCU+FPU, 210 DMIPS, 512 kB Flash, 192 kB Internal RAM, 82 I/Os, 100-pin LQFP, -40 to 85 degC, Tray; Manufacturer: STMicroelectronics; Supply Voltage(Vcc) max (V): 3.6; Supply Voltage(Vcc) min (V): 1.8; I/Os (High Current): 82; FLASH Size (Prog) (kB): 512; Operating Frequency(F) (Processor speed) (MHz): 168; D/A Converter: 2x12-bit; Internal RAM Size (kB): 192; PackageReference: LQFP100; Core: ARM Cortex-M4; ComponentLink1URL: http://www.st.com/web/en/home.html; ComponentLink1Description: Manufacturer URL; DatasheetVersion: Rev. 4; Packing: Tray; Mounting Technology: Surface Mount; ComponentLink2Description: Datasheet; ComponentLink2URL: http://www.st.com/st-web-ui/static/active/en/resource/technical/document/datasheet/DM00037051.pdf; ComponentLink3Description: Package Specification; PartNumber: STM32F407VET6; PackageVersion: Rev. 1, 06/2013; PackageDescription: 100-Pin Low Profile Quad Flat Package, 14 x 14 mm Body, 0.5 mm Pitch; ComponentLink3URL: http://www.st.com/st-web-ui/static/active/en/resource/technical/document/data_brief/DM00071938.pdf
XTAL1 = CMP-361-000000-2: 8MHz Surface mount crystal oscillator 20pF ±10ppm ±20ppm SMD5032 Crystals ROHS; Mfr_Name: YXC; Source: X50328MSB2GI.SchLib; Design Item ID: X50328MSB2GI; Type: Crystals

## Sheet Drivers.SchDoc
size A3; SheetNumber: 3; SheetTotal: 6
Used 14 times, as channels U_Drivers, U_Drivers, U_Drivers, U_Drivers, U_Drivers, U_Drivers, U_Drivers, U_Drivers, U_Drivers, U_Drivers, U_Drivers, U_Drivers, U_Drivers, U_Drivers. Parts and nets are listed once, with the designators drawn on the sheet.
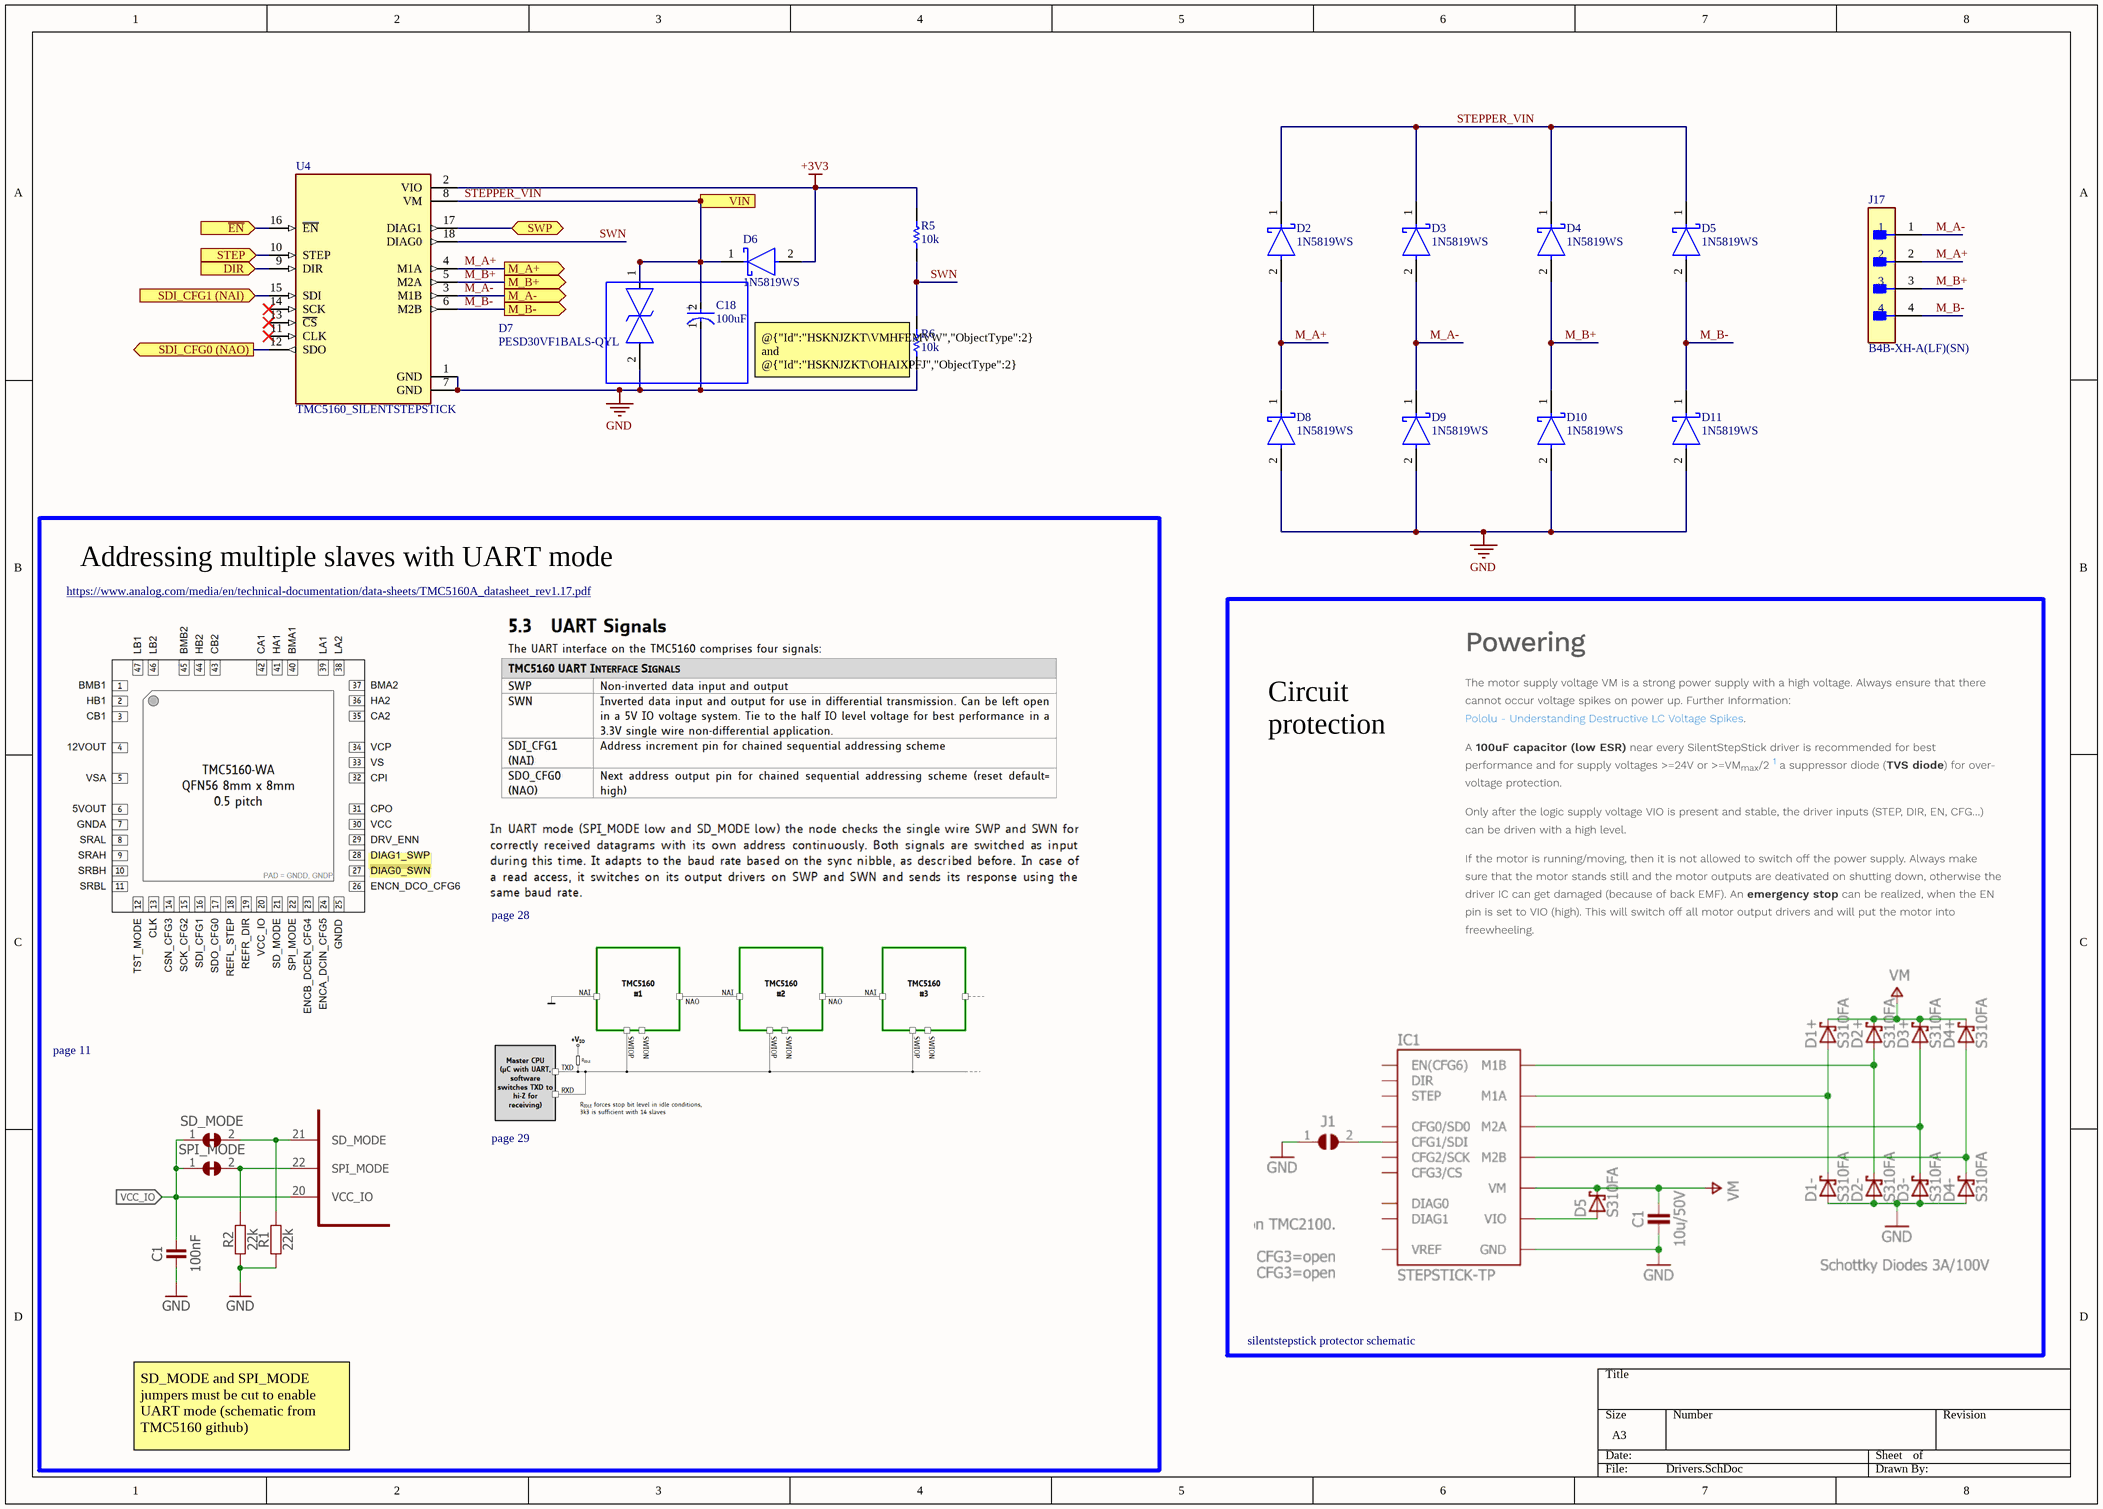
[diagram p9: Drivers.SchDoc]

### Parts
C18  100uF  [FP-UWT1H101MNL1GS-MFG]
D2  1N5819WS  [FP-477-02-MFG]
D3  1N5819WS  [FP-477-02-MFG]
D4  1N5819WS  [FP-477-02-MFG]
D5  1N5819WS  [FP-477-02-MFG]
D6  1N5819WS  [FP-477-02-MFG]
D7  PESD30VF1BALS-QYL  [PESD30VF1BALSQYL]
D8  1N5819WS  [FP-477-02-MFG]
D9  1N5819WS  [FP-477-02-MFG]
D10  1N5819WS  [FP-477-02-MFG]
D11  1N5819WS  [FP-477-02-MFG]
J17  B4B-XH-A(LF)(SN)  [FP-B4B-XH-A_LF_SN-MFG]
R5  Resistance: 10k  [RESC1609X50X30NL8T20]  (hidden comment: 0603WAF1002T5E)
R6  Resistance: 10k  [RESC1609X50X30NL8T20]  (hidden comment: 0603WAF1002T5E)
U4  TMC5160_SILENTSTEPSTICK  [MODULE_TMC5160_SILENTSTEPSTICK]

### Ports
DIR (in, see Actuation[3D]), M_A+ (out, see Actuation[4C]), M_A- (out, see Actuation[4C]), M_B+ (out, see Actuation[4D]), M_B- (out, see Actuation[4D]), SDI_CFG0 (NAO) (out, see Actuation[4D]), SDI_CFG1 (NAI) (in, see Actuation[3D]), STEP (in, see Actuation[3D]), SWP (bidir, see Actuation[3D]), VIN (in, see Actuation[3C], Power[1A]), ~{EN} (in, see Actuation[3C])

### Nets
+3V3: D6.2(A) R5.2 U4.2(VIO)
GND: C18.1(C) D7.2 D8.2(A) D9.2(A) D10.2(A) D11.2(A) R6.1 U4.1(GND) U4.7(GND)
DIR: U4.9(DIR) ; port DIR
~{EN}: U4.16(~{EN}) ; port ~{EN}
M_A+: D2.2(A) D8.1(C) J17.2 U4.4(M1A) ; port M_A+
M_A-: D3.2(A) D9.1(C) J17.1 U4.3(M1B) ; port M_A-
M_B+: D4.2(A) D10.1(C) J17.3 U4.5(M2A) ; port M_B+
M_B-: D5.2(A) D11.1(C) J17.4 U4.6(M2B) ; port M_B-
SDI_CFG0 (NAO): U4.12(SDO) ; port SDI_CFG0 (NAO)
SDI_CFG1 (NAI): U4.15(SDI) ; port SDI_CFG1 (NAI)
STEP: U4.10(STEP) ; port STEP
STEPPER_VIN: C18.2(A) D2.1(C) D3.1(C) D4.1(C) D5.1(C) D6.1(C) D7.1 U4.8(VM) ; port VIN
SWN: R5.1 R6.2 U4.18(DIAG0)
SWP: U4.17(DIAG1) ; port SWP

Not connected (* = marked no-connect by the designer): U4 11(CLK)* 13(~{CS})* 14(SCK)*

### Channels
U_Drivers: designators end in _U_Drivers#1; ports DIR=DIR_8 M_A+=M1_A+ M_A-=M1_A- M_B+=M1_B+ M_B-=M1_B- SDI_CFG0 (NAO)=NetU4_U_Drivers#1_12 SDI_CFG1 (NAI)=NetU4_U_Drivers#1_15 STEP=PWM_8 SWP=TMC5160_UART VIN=STEPPER_VIN ~{EN}=EN_8
U_Drivers: designators end in _U_Drivers#2; ports DIR=DIR_2 M_A+=M2_A+ M_A-=M2_A- M_B+=M2_B+ M_B-=M2_B- SDI_CFG0 (NAO)=NetU4_U_Drivers#2_12 SDI_CFG1 (NAI)=NetU4_U_Drivers#2_15 STEP=PWM_2 SWP=TMC5160_UART VIN=STEPPER_VIN ~{EN}=EN_2
U_Drivers: designators end in _U_Drivers#3; ports DIR=DIR_5 M_A+=M5_A+ M_A-=M5_A- M_B+=M5_B+ M_B-=M5_B- SDI_CFG0 (NAO)=NetU4_U_Drivers#3_12 SDI_CFG1 (NAI)=NetU4_U_Drivers#2_12 STEP=PWM_5 SWP=TMC5160_UART VIN=STEPPER_VIN ~{EN}=EN_5
U_Drivers: designators end in _U_Drivers#4; ports DIR=DIR_6 M_A+=M6_A+ M_A-=M6_A- M_B+=M6_B+ M_B-=M6_B- SDI_CFG0 (NAO)=NetU4_U_Drivers#4_12 SDI_CFG1 (NAI)=NetU4_U_Drivers#4_15 STEP=PWM_6 SWP=TMC5160_UART VIN=STEPPER_VIN ~{EN}=EN_6
U_Drivers: designators end in _U_Drivers#5; ports DIR=DIR_7 M_A+=M7_A+ M_A-=M7_A- M_B+=M7_B+ M_B-=M7_B- SDI_CFG0 (NAO)=NetU4_U_Drivers#4_15 SDI_CFG1 (NAI)=NetU4_U_Drivers#3_12 STEP=PWM_7 SWP=TMC5160_UART VIN=STEPPER_VIN ~{EN}=EN_7
U_Drivers: designators end in _U_Drivers#6; ports DIR=DIR_3 M_A+=M3_A+ M_A-=M3_A- M_B+=M3_B+ M_B-=M3_B- SDI_CFG0 (NAO)=NetU4_U_Drivers#1_15 SDI_CFG1 (NAI)=NetU4_U_Drivers#6_15 STEP=PWM_3 SWP=TMC5160_UART VIN=STEPPER_VIN ~{EN}=EN_3
U_Drivers: designators end in _U_Drivers#7; ports DIR=DIR_4 M_A+=M4_A+ M_A-=M4_A- M_B+=M4_B+ M_B-=M4_B- SDI_CFG0 (NAO)=NetU4_U_Drivers#6_15 SDI_CFG1 (NAI)=NetU4_U_Drivers#4_12 STEP=PWM_4 SWP=TMC5160_UART VIN=STEPPER_VIN ~{EN}=EN_4
U_Drivers: designators end in _U_Drivers#8; ports DIR=DIR_12 M_A+=M12_A+ M_A-=M12_A- M_B+=M12_B+ M_B-=M12_B- SDI_CFG0 (NAO)=NetU4_U_Drivers#8_12 SDI_CFG1 (NAI)=NetU4_U_Drivers#8_15 STEP=PWM_12 SWP=TMC5160_UART VIN=STEPPER_VIN ~{EN}=EN_12
U_Drivers: designators end in _U_Drivers#9; ports DIR=DIR_13 M_A+=M13_A+ M_A-=M13_A- M_B+=M13_B+ M_B-=M13_B- SDI_CFG0 (NAO)=NetU4_U_Drivers#9_12 SDI_CFG1 (NAI)=NetU4_U_Drivers#9_15 STEP=PWM_13 SWP=TMC5160_UART VIN=STEPPER_VIN ~{EN}=EN_13
U_Drivers: designators end in _U_Drivers#10; ports DIR=DIR_14 M_A+=M14_A+ M_A-=M14_A- M_B+=M14_B+ M_B-=M14_B- SDI_CFG0 (NAO)=NetU4_U_Drivers#2_15 SDI_CFG1 (NAI)=NetU4_U_Drivers#9_12 STEP=PWM_14 SWP=TMC5160_UART VIN=STEPPER_VIN ~{EN}=EN_14
U_Drivers: designators end in _U_Drivers#11; ports DIR=DIR_15 M_A+=M8_A+ M_A-=M8_A- M_B+=M8_B+ M_B-=M8_B- SDI_CFG0 (NAO)=NetU4_U_Drivers#11_12 SDI_CFG1 (NAI)=NetU4_U_Drivers#1_12 STEP=PWM_15 SWP=TMC5160_UART VIN=STEPPER_VIN ~{EN}=EN_15
U_Drivers: designators end in _U_Drivers#12; ports DIR=DIR_9 M_A+=M9_A+ M_A-=M9_A- M_B+=M9_B+ M_B-=M9_B- SDI_CFG0 (NAO)=NetU4_U_Drivers#8_15 SDI_CFG1 (NAI)=NetU4_U_Drivers#12_15 STEP=PWM_9 SWP=TMC5160_UART VIN=STEPPER_VIN ~{EN}=EN_9
U_Drivers: designators end in _U_Drivers#13; ports DIR=DIR_10 M_A+=M10_A+ M_A-=M10_A- M_B+=M10_B+ M_B-=M10_B- SDI_CFG0 (NAO)=NetU4_U_Drivers#12_15 SDI_CFG1 (NAI)=NetU4_U_Drivers#11_12 STEP=PWM_10 SWP=TMC5160_UART VIN=STEPPER_VIN ~{EN}=EN_10
U_Drivers: designators end in _U_Drivers#14; ports DIR=DIR_11 M_A+=M11_A+ M_A-=M11_A- M_B+=M11_B+ M_B-=M11_B- SDI_CFG0 (NAO)=NetU4_U_Drivers#9_15 SDI_CFG1 (NAI)=GND STEP=PWM_11 SWP=TMC5160_UART VIN=STEPPER_VIN ~{EN}=EN_11

### Notes on the sheet
- (near R6) @{"Id":"HSKNJZKT\VMHFEMVW","ObjectType":2} and @{"Id":"HSKNJZKT\OHAIXPFJ","ObjectType":2} sized for ASV specifications, double check whether fits AUV specifications
- Addressing multiple slaves with UART mode
- https://www.analog.com/media/en/technical-documentation/data-sheets/TMC5160A_datasheet_rev1.17.pdf
- Circuit protection
- page 28
- page 11
- page 29
- silentstepstick protector schematic
- SD_MODE and SPI_MODE jumpers must be cut to enable UART mode (schematic from TMC5160 github)
- (in symbol CMP-2000-07373-2) +

### Library data of the parts
C18 = CMP-2000-07373-2: CAP ALUM 100UF 20% 50V SMD; Leakage Current: 3uA; Ripple Current: 140mA; Life (Hours): 1000Hour; Dissipation Factor: 0.14%; Dielectric Material: Aluminium; Termination: SMD/SMT; Tolerance: 20%; Package Quantity: 500; Capacitance: 100uF; Height: 10mm; REACH SVHC: No SVHC; Case/Package: Radial; Series: WT; Diameter: 8mm; Voltage Rating: 50V; Construction: Cylindrical; Length: 10mm; Min Operating Temperature: -55°C; Max Operating Temperature: 105°C; Voltage Rating (DC): 50V; Packaging: Tape and Reel; Voltage: 50V; Mount: Surface Mount; Ripple Current (AC): 140mA; Radiation Hardening: No; Number of Pins: 2; Lead Free: Lead Free; Height - Seated (Max): 0.413inch; RoHS Compliant: Yes
D2-D6 D8-D11 = CMP-1055-00464-2: 40V 600mV@1A 1A SOD-323 Schottky Barrier Diodes (SBD) ROHS; Standoff Height: 0mm; Category: Diode; Package: 477-02; Height: 1.1mm
D7 = CMP-241-000004-1: 21V (Typ) Clamp Ipp Tvs Diode Surface Mount DFN1006-2; Manufacturer_Name: Nexperia; Datasheet Link: https://assets.nexperia.com/documents/data-sheet/PESD30VF1BALS-Q.pdf; Height: 0.5mm; Manufacturer_Part_Number: PESD30VF1BALS-QYL; Mouser Part Number: 771-PESD30VF1BALSQYL; Mouser Price/Stock: https://www.mouser.co.uk/ProductDetail/Nexperia/PESD30VF1BALS-QYL?qs=dbcCsuKDzFU1CRQIDaUBEA%3D%3D; Source: SamacSys.SchLib; Design Item ID: PESD30VF1BALS-QYL
J17 = CMP-17439-000250-1: CONN HEADER VERT 4POS 2.5MM; Number of Contacts: 4; Contact Resistance: 20mR; Voltage Rating: 250V; Max Current Rating: 3A; Gender: Male; Wire/Cable Gauge: 22AWG; Mated Stacking Heights: 9.8mm; Insulation Resistance: 1GR; Orientation: Straight; Contact Type: Male Pin; Contact Finish - Mating: TIN; Series: XH; Max Voltage Rating (AC): 250V; Lead Pitch: 2.5mm; Contact Shape: Square; Insulation Color: Natural; Termination: Solder; Lead Free: Lead Free; Voltage Rating (AC): 250V; Number of Rows: 1; Flammability Rating: UL94 V-0; Number of Positions: 4; Max Operating Temperature: 85°C; Package Quantity: 500; Mount: Through Hole; REACH SVHC: No SVHC; Connector Type: Header; Insulation Material: Nylon; Fastening Type: Detent; Min Operating Temperature: -25°C; Housing Color: White; Packaging: Bulk; Contact Plating: Tin; Contact Material: Brass; Max Voltage Rating (DC): 250V; Housing Material: Polyamide; Color: Natural; Material: Polyamide; Pitch: 2.5mm; Depth: 5.75mm; Current Rating: 3A; Length: 12.4mm
R5 R6 = CMP-1666-00005-4: as R1 on sheet STM32F407VET6; Max Operating Temperature: 155 degC; Voltage Rating: 75 V; PackageDescription: 2-Pin Surface Mount Device, Body 1.575 x 0.85 mm; ComponentLink1Description: Manufacturer URL; RoHSCompliant: true; PackageReference: 0603; REACH SVHC: Unknown; Length: 1.55 mm; Packaging: Tape and Reel; Min Operating Temperature: -55 degC; Mounting Technology: Surface Mount; ComponentLink2URL: https://datasheet.ciiva.com/11809/0900766b80d98afc-11809037.pdf; Height: 0.45 mm; ComponentLink2Description: Datasheet; Package Quantity: 5000; ComponentLink1URL: http://www.vishay.com/
U4 = CMP-092-000004-2: TMC5160 SilentStepStick Motor Driver; MF: Trinamic Motion Control GmbH; Value: *; MP: TMC5160_SILENTSTEPSTICK; Design Item ID: TMC5160_SILENTSTEPSTICK; Check_prices: https://www.snapeda.com/parts/TMC5160%20SILENTSTEPSTICK/Trinamic%20Motion%20Control%20GmbH/view-part/?ref=search&t=tmc5160%20silentstep%20stick; Package: None; Source: TMC5160_SILENTSTEPSTICK.SchLib; Pin Count: 18; SnapEDA_Link: https://www.snapeda.com/parts/TMC5160%20SILENTSTEPSTICK/Trinamic%20Motion%20Control%20GmbH/view-part/?ref=search&t=tmc5160%20silentstep%20stick; Price: None; Availability: In Stock; Purchase-URL: https://pricing.snapeda.com/parts/TMC5160SILENTSTEPSTICK/Trinamic%20Motion%20Control%20GmbH/view-part?uid=6097338; Component Type: Standard